# Altium schematic sheet Sound.SchDoc: Sound
size A4
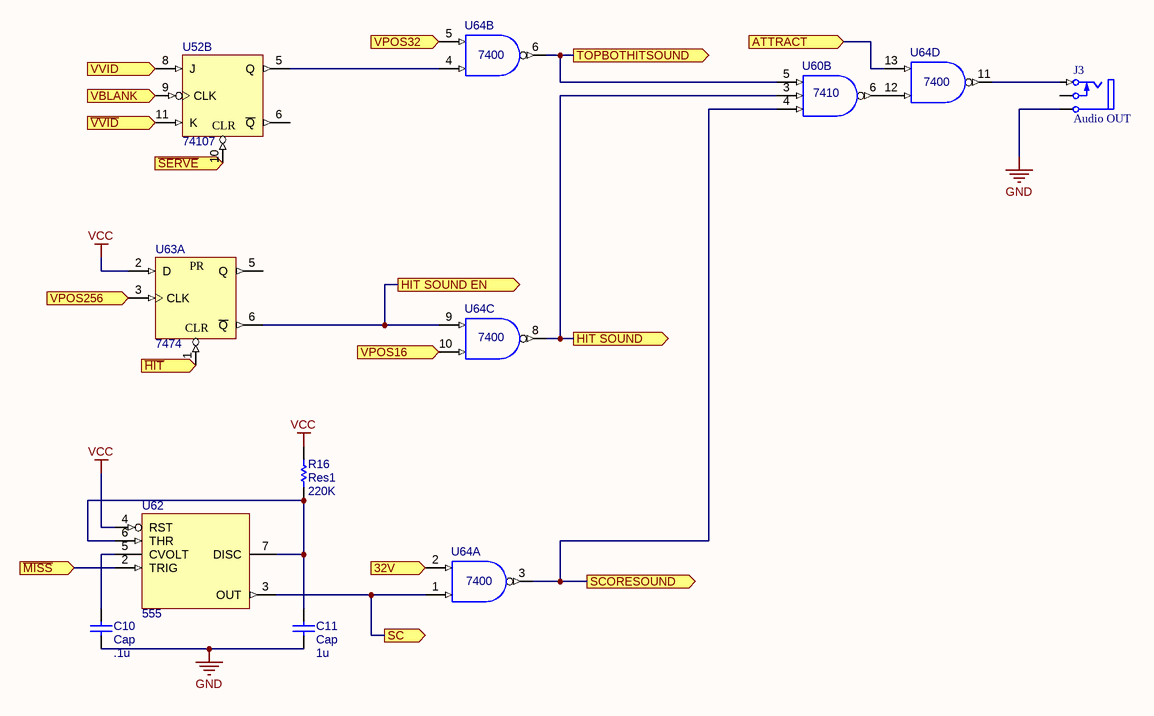
[diagram p0: Sound.SchDoc]

## Parts
C10  Cap  value .1u  [CAPR10.16-11.5x3.6]
C11  Cap  value 1u  [CAPR10.16-11.5x3.6]
J3  Audio OUT  [RCA 2]
R16  Res1  value 220K  [AXIAL-0.4]
U52  74107  [N014]  (part B of 2)
U60  7410  [N014]  (part B of 3)
U62  555  [P008]
U63  7474  [N014D]  (part A of 2)
U64  7400  [N014]  (parts A,B,C,D of 4)

## Ports
32V, ATTRACT, HIT SOUND, HIT SOUND EN, SC, SCORESOUND, TOPBOTHITSOUND, VBLANK, VPOS16, VPOS32, VPOS256, VVID, ~{HIT}, ~{MISS}, ~{SERVE}, ~{VVID}

## Nets
GND: C10.1 C11.1 J3.1(S) U52.7(GND) U60.7(GND) U62.1(GND) U63.7(GND) U64.7(GND)
VCC: R16.2 U52.14(VCC) U60.14(VCC) U62.4(RST) U62.8(VCC) U63.2(D) U63.4(PR) U63.14(VCC) U64.14(VCC)
32V: U64.2(B) ; port 32V
~{HIT}: U63.1(CLR) ; port ~{HIT}
~{MISS}: U62.2(TRIG) ; port ~{MISS}
~{SERVE}: U52.10(CLR) ; port ~{SERVE}
~{VVID}: U52.11(K) ; port ~{VVID}
ATTRACT: U64.13(B) ; port ATTRACT
HIT SOUND: U60.3(A) U64.8(Y) ; port HIT SOUND
HIT SOUND EN: U63.6(~{Q}) U64.9(A) ; port HIT SOUND EN
SC: U62.3(OUT) U64.1(A) ; port SC
SCORESOUND: U60.4(B) U64.3(Y) ; port SCORESOUND
TOPBOTHITSOUND: U60.5(C) U64.6(Y) ; port TOPBOTHITSOUND
VBLANK: U52.9(CLK) ; port VBLANK
VPOS16: U64.10(B) ; port VPOS16
VPOS32: U64.5(B) ; port VPOS32
VPOS256: U63.3(CLK) ; port VPOS256
VVID: U52.8(J) ; port VVID
NetC10_2: C10.2 U62.5(CVOLT)
NetC11_2: C11.2 R16.1 U62.6(THR) U62.7(DISC)
NetJ3_2: J3.2(T) U64.11(Y)
NetU52_5: U52.5(Q) U64.4(A)
NetU60_6: U60.6(Y) U64.12(A)

Not connected (* = marked no-connect by the designer): J3 3(TN); U52 6(~{Q}); U63 5(Q)

## Notes on the sheet
- Text
- Page
- PONG

## Library data of the parts
C10 C11 = Cap: Capacitor; Published: 8-Jun-2000; LatestRevisionDate: 17-Jul-2002; LatestRevisionNote: Re-released for DXP Platform.; PackageReference: RAD-0.3; Publisher: Altium Limited; PackageDescription: Radial Cap, Thru-Hole; 2 Leads; 0.3 in Pin Spacing
J3 = Phonejack2 TN: Jack Socket, 1/4" [6.5mm], Thru-Hole, Vertical, 2-Conductor with Tip closed; PackageDocument: 2003; PCB_Layout: Complies with manufacturer's recommendation.; DrillAndSlotSize: Corresponds to nominal value.; LatestRevisionDate: 15-Jul-2004; LatestRevisionNote: Component Replaced & renamed from "Phonejack".; DatasheetDocument: 2003; PackageReference: S1VS_SNB; Publisher: Altium Limited; ComponentLink1Description: Manufacturer Link; ComponentLink1URL: http://www.cliffuk.co.uk/
R16 = Res1: Resistor; Published: 8-Jun-2000; LatestRevisionDate: 17-Jul-2002; LatestRevisionNote: Re-released for DXP Platform.; PackageReference: AXIAL-0.3; Publisher: Altium Limited; PackageDescription: Axial Device, Thru-Hole; 2 Leads; 0.3 in Pin Spacing
U52 = SN74LS107AN: Dual J-K Flip-Flop with Clear; Published: 8-Jun-2000; LatestRevisionDate: 04-Mar-2005; LatestRevisionNote: Stylized 3D Model Added.; DatasheetVersion: Mar-1988; PackageVersion: Oct-1995; PackageReference: N014; Publisher: Altium Limited; PackageDescription: DIP; 14 Leads; Row Spacing 7.62 mm; Pitch 2.54 mm; ComponentLink1Description: Manufacturer Link; ComponentLink1URL: http://www.ti.com/; ComponentLink2Description: Datasheet; ComponentLink2URL: http://www-s.ti.com/sc/ds/sn74ls107a.pdf
U60 = SN74LS10N: Triple 3-Input Positive-NAND Gate; Published: 8-Jun-2000; LatestRevisionDate: 04-Mar-2005; LatestRevisionNote: Stylized 3D Model Added.; DatasheetVersion: Mar-1988; PackageVersion: Oct-1995; PackageReference: N014; Publisher: Altium Limited; PackageDescription: DIP; 14 Leads; Row Spacing 7.62 mm; Pitch 2.54 mm; ComponentLink1Description: Manufacturer Link; ComponentLink1URL: http://www.ti.com/; ComponentLink2Description: Datasheet; ComponentLink2URL: http://www-s.ti.com/sc/ds/sn74ls10.pdf
U62 = NE555P: Precision Timer; Published: 16-Jan-2001; LatestRevisionDate: 04-Mar-2005; LatestRevisionNote: Stylized 3D Model Added.; DatasheetVersion: Feb-1992; PackageVersion: Jun-1999; PackageReference: P008; Publisher: Altium Limited; PackageDescription: DIP; 8 Leads; Row Spacing 7.62 mm; Pitch 2.54 mm; Code_JEDEC: MO-001-AN; ComponentLink1Description: Manufacturer Link; ComponentLink1URL: http://www.ti.com/; ComponentLink2Description: Datasheet; ComponentLink2URL: http://www-s.ti.com/sc/ds/ne555.pdf
U63 = SN74LS74AN: Dual D-Type Positive-Edge-Triggered Flip-Flop with Preset and Clear; Published: 8-Jun-2000; LatestRevisionDate: 04-Mar-2005; LatestRevisionNote: Stylized 3D Model Added.; DatasheetVersion: Mar-1988; PackageVersion: Oct-1995; PackageReference: N014D; Publisher: Altium Limited; PackageDescription: DIP; 14 Leads; Row Spacing 7.62 mm; Pitch 2.54 mm; ComponentLink1Description: Manufacturer Link; ComponentLink1URL: http://www.ti.com/; ComponentLink2Description: Datasheet; ComponentLink2URL: http://www-s.ti.com/sc/ds/sn74ls74a.pdf
U64 = SN74LS00N: Quadruple 2-Input Positive-NAND Gate; Published: 8-Jun-2000; LatestRevisionDate: 04-Mar-2005; LatestRevisionNote: Stylized 3D Model Added.; DatasheetVersion: Mar-1988; PackageVersion: Oct-1995; PackageReference: N014; Publisher: Altium Limited; PackageDescription: DIP; 14 Leads; Row Spacing 7.62 mm; Pitch 2.54 mm; ComponentLink1Description: Manufacturer Link; ComponentLink1URL: http://www.ti.com/; ComponentLink2Description: Datasheet; ComponentLink2URL: http://www-s.ti.com/sc/ds/sn74ls00.pdf